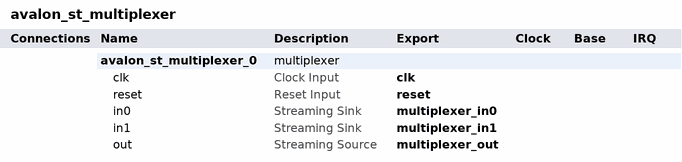
[diagram p0: system contents]
# Platform Designer (Qsys) system avalon_st_multiplexer, Cyclone 10 GX 10CX220YF780E5G
# Parameters at their usual value, and those the tool derives, are not listed.
package require -exact qsys 1.0
create_system avalon_st_multiplexer
set_project_property DEVICE_FAMILY {Cyclone 10 GX}
set_project_property DEVICE 10CX220YF780E5G

add_component avalon_st_multiplexer_0 ip/avalon_st_multiplexer/avalon_st_multiplexer_0.ip multiplexer avalon_st_multiplexer_0 18.1
load_component avalon_st_multiplexer_0
set_component_parameter_value outChannelWidth 1
set_component_parameter_value bitsPerSymbol 72
set_component_parameter_value usePackets true
set_component_parameter_value inUsePackets true
set_component_parameter_value inUseEmptyPort AUTO
set_component_parameter_value inUseEmpty false
set_component_parameter_value numInputInterfaces 2
set_component_parameter_value schedulingSize 2
set_component_parameter_value packetScheduling true
set_component_parameter_value useHighBitsOfChannel false
set_component_parameter_value symbolsPerBeat 1
set_component_parameter_value errorWidth 0
set_component_parameter_value inErrorWidth 0
save_component

# exported interfaces
add_interface clk clock sink
set_interface_property clk EXPORT_OF avalon_st_multiplexer_0.clk
add_interface multiplexer_in0 avalon_streaming sink
set_interface_property multiplexer_in0 EXPORT_OF avalon_st_multiplexer_0.in0
add_interface multiplexer_in1 avalon_streaming sink
set_interface_property multiplexer_in1 EXPORT_OF avalon_st_multiplexer_0.in1
add_interface multiplexer_out avalon_streaming source
set_interface_property multiplexer_out EXPORT_OF avalon_st_multiplexer_0.out
add_interface reset reset sink
set_interface_property reset EXPORT_OF avalon_st_multiplexer_0.reset

set_interconnect_requirement {$system} qsys_mm.clockCrossingAdapter HANDSHAKE
set_interconnect_requirement {$system} qsys_mm.enableEccProtection FALSE
set_interconnect_requirement {$system} qsys_mm.insertDefaultSlave FALSE
set_interconnect_requirement {$system} qsys_mm.maxAdditionalLatency 1

save_system avalon_st_multiplexer.qsys
